# Altium schematic sheet ELC0205-Wiring.SchDoc
size Letter; PageSetup: Record=PageOptions|CenterHorizontal=True|CenterVertical=True|PrintScale=1.07|XCorrection=1.00|YCorrection=1.00|PrintKind=2|BorderSize=5000000|LeftOffset=0|BottomOffset=0|Orientation=2|PaperLength=1000|PaperWidth=1000|Scale=100|PaperSource=15|PrintQuality=1200|MediaType=1|DitherType=10|PaperKind=Letter|PrintScaleMode=1
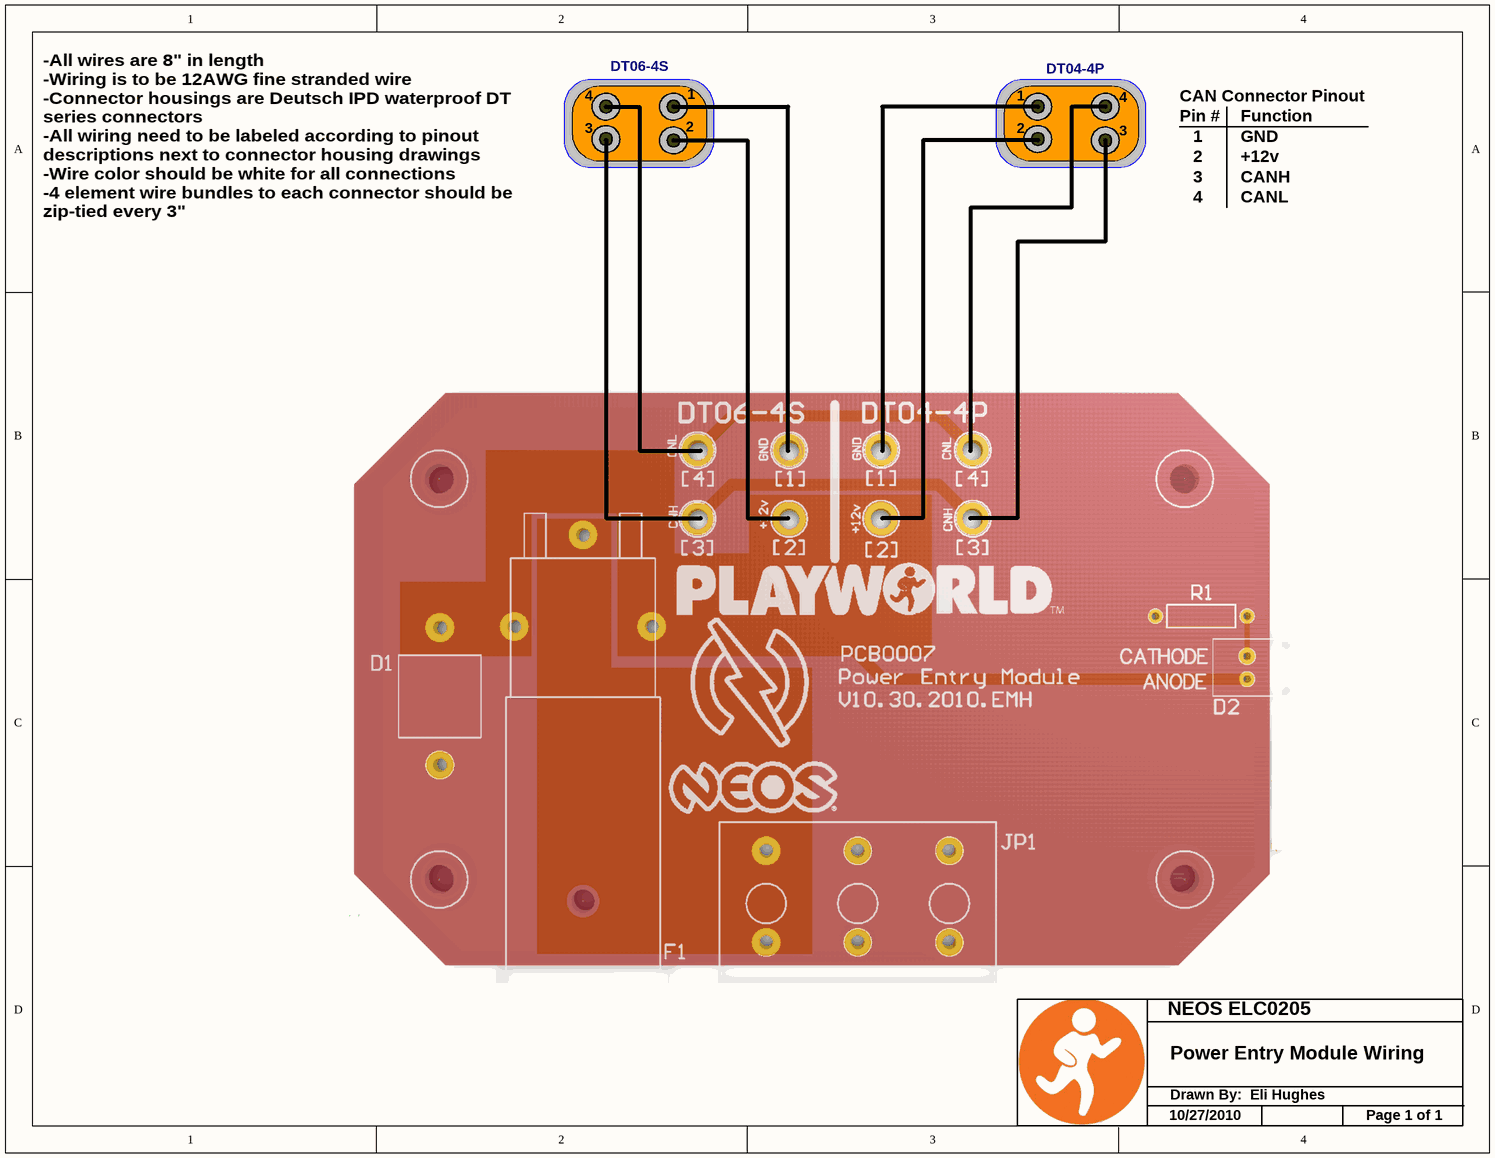
[diagram p0: ELC0205-Wiring.SchDoc]

## Notes on the sheet
- 4
- DT06-4S
- 1
- DT04-4P
- CAN Connector Pinout
- 3
- 2
- Pin #
- Function
- GND
- +12v
- CANH
- CANL
- -All wires are 8" in length
  -Wiring is to be 12AWG fine stranded wire
  -Connector housings are Deutsch IPD waterproof DT series connectors
  -All wiring need to be labeled according to pinout descriptions next to connector housing drawings
  -Wire color should be white for all connections
  -4 element wire bundles to each connector should be zip-tied every 3"
- NEOS ELC0205
- Power Entry Module Wiring
- Drawn By:  Eli Hughes
- 10/27/2010
- Page 1 of 1